# EAGLE design flame sensor final (EAGLE 7.5.0)
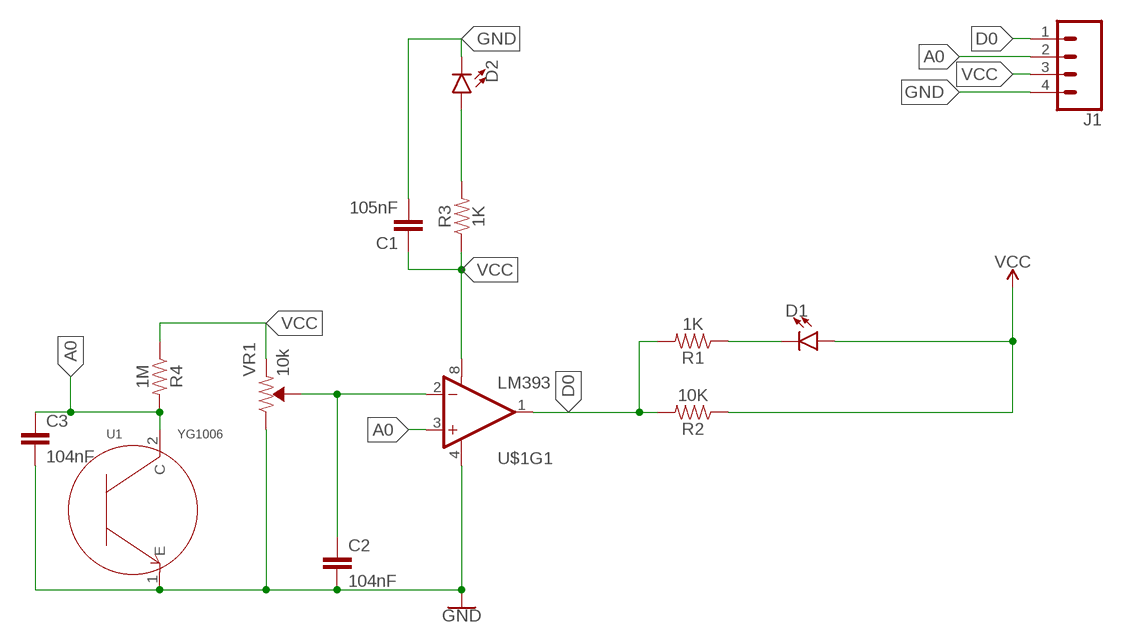
[diagram p0: schematic, sheet 1]

## Parts
C1  105nF  2.2UF-1206-50V-10%  [1206]
C2  104nF  2.2UF-1206-50V-10%  [1206]
C3  104nF  2.2UF-1206-50V-10%  [1206]
D1  LED1206  [LED-1206]
D2  LED1206  [LED-1206]
J1  CONN_04  [1X04]
R1  1K  0.05OHM-0603-1/5W-1%  [0603]
R2  10K  0.05OHM-0603-1/5W-1%  [0603]
R3  1K  0.05OHM-0603-1/5W-1%  [0603]
R4  1M  0.05OHM-0603-1/5W-1%  [0603]
U1  YG1006  YG1006'YG1006'  [2P-2.54-5MM]
U$1  LM393  [SO08]
VR1  10k  TRIMPOT-SMD-5MM-CLOSED-1/4W-20%  [TRIMPOT-SMD-5MM]

## Nets
A0: C3.1 J1.2 R4.2 U1.2(C) U$1.3(+IN)
D0: J1.1 R1.2 R2.2 U$1.1(OUT)
GND: C1.2 C2.2 C3.2 D2.C J1.4 U1.1(E) U$1.4(V-) VR1.C(CW)
N$1: D1.C R1.1
N$2: C2.1 U$1.2(-IN) VR1.B(WIPER)
N$3: D2.A R3.2
VCC: C1.1 D1.A J1.3 R2.1 R3.1 R4.1 U$1.8(V+) VR1.A(CCW)
Unconnected: U$1.5(+IN) U$1.6(-IN) U$1.7(OUT)

## Library data of the parts
C1-C3 = SparkFun-Capacitors:2.2UF: 2.2µF ceramic capacitors A capacitor is a passive two-terminal electrical component used to store electrical energy temporarily in an electric field.; PROD_ID: CAP-10009; VALUE: 2.2uF
D1 D2 = SparkFun-LED:LED: LED (Generic) Standard schematic elements and footprints for 5mm, 3mm, 1206, and 0603 sized LEDs. Generic LEDs with no color specified.
J1 = SparkFun-Connectors:CONN_04: Multi connection point. Often used as Generic Header-pin footprint for 0.1 inch spaced/style header connections On any of the 0.1 inch spaced packages, you can populate with these: Break Away Headers - Straight <https://www.sparkfun.com/products/116> (PRT-00116) Break Away Male Headers - Right Angle <https://www.sparkfun.com/products/553> (PRT-00553) Female Headers <https://www.sparkfun.com/products/115> (PRT-00115) Break Away Headers - Machine Pin <https://www.sparkfun.com/products/117> (PRT-00117) Break Away Female Headers - Swiss Machine Pin <https://www.sparkfun.com/products/743> (PRT-00743) For SCREWTERMINALS and SPRING TERMINALS visit here: Screw Terimnals on SparkFun.com <https://www.sparkfun.com/search/results?term=Screw+Terminals> (5mm/3.5mm/2.54mm spacing) This device is also useful as a general connection point to wire up your design to another part of your project. Our various solder wires solder well into these plated through hole pads. Hook-Up Wire - Assortment (Stranded, 22 AWG) <https://www.sparkfun.com/products/11375> (PRT-11375) Hook-Up Wire - Assortment (Solid Core, 22 AWG) <https://www.sparkfun.com/products/11367> (PRT-11367) View the entire wire category on our website here <https://www.sparkfun.com/categories/141> Special notes: Molex polarized connector foot print use with SKU : PRT-08231 with associated crimp pins and housings. 1MM SMD Version SKU: PRT-10208; PROD_ID: CONN-09696
R1-R4 = SparkFun-Resistors:0.05OHM: 0.05Ω resistor A resistor is a passive two-terminal electrical component that implements electrical resistance as a circuit element. Resistors act to reduce current flow, and, at the same time, act to lower voltage levels within circuits. - Wikipedia; PROD_ID: RES-12535; VALUE: 0.05
U1 = template(1):YG1006: YG1006 is a high speed and high sensitive NPN siicon phototransistor in a atandard 5mm package
U$1 = SparkFun-Retired:LM393: Low-voltage comparator Prototype: IC-09375
VR1 = SparkFun-Resistors:TRIMPOT: Trimming Potentiometer (Trimpot) Three-terminal potentiometers, with an adjustable wiper and two adjustable resistors. A pot can be used to create a configurable voltage divider, or as a variable resistor. "Trimpots" are a subset of potentiometers, usually intended for "set-and-forget" applications. They're often more delicate than standard potentiometers - rated for fewer turns. Variants PTH-KNOB - PTH Trimpot w/ finger-adjustable knob Trimpot 10K with Knob <https://www.sparkfun.com/products/9806> (COM-09806) Datasheet <http://www.sparkfun.com/datasheets/Components/General/TSR-3386.pdf> SMD-3MM-CLOSED-FRAME - SMD 3mm Square Closed-Frame Trimpot Used on e.g. EasyDriver - Stepper Motor Driver <https://www.sparkfun.com/products/12779> Datasheet <http://www.bitechnologies.com/pdfs/22.pdf> (22AR10KTR) SMD-5MM - SMD 5mm Square Closed-Frame Trimpot Used on e.g. IOIO-OTG - V2.2 <https://www.sparkfun.com/products/13613> Datasheet <http://www.vishay.com/docs/51008/ts53.pdf> (TS53YL502MR10) SMD-3MM-1/10W-25% - 3mm Square Open-Frame Trimpot Used on e.g. SparkFun Shapeoko <https://www.sparkfun.com/products/13899> Datasheet <http://www.bourns.com/docs/Product-Datasheets/TC33.pdf> (TC33X-2-103E); PROD_ID: RES-11156; VALUE: 5k

## Board
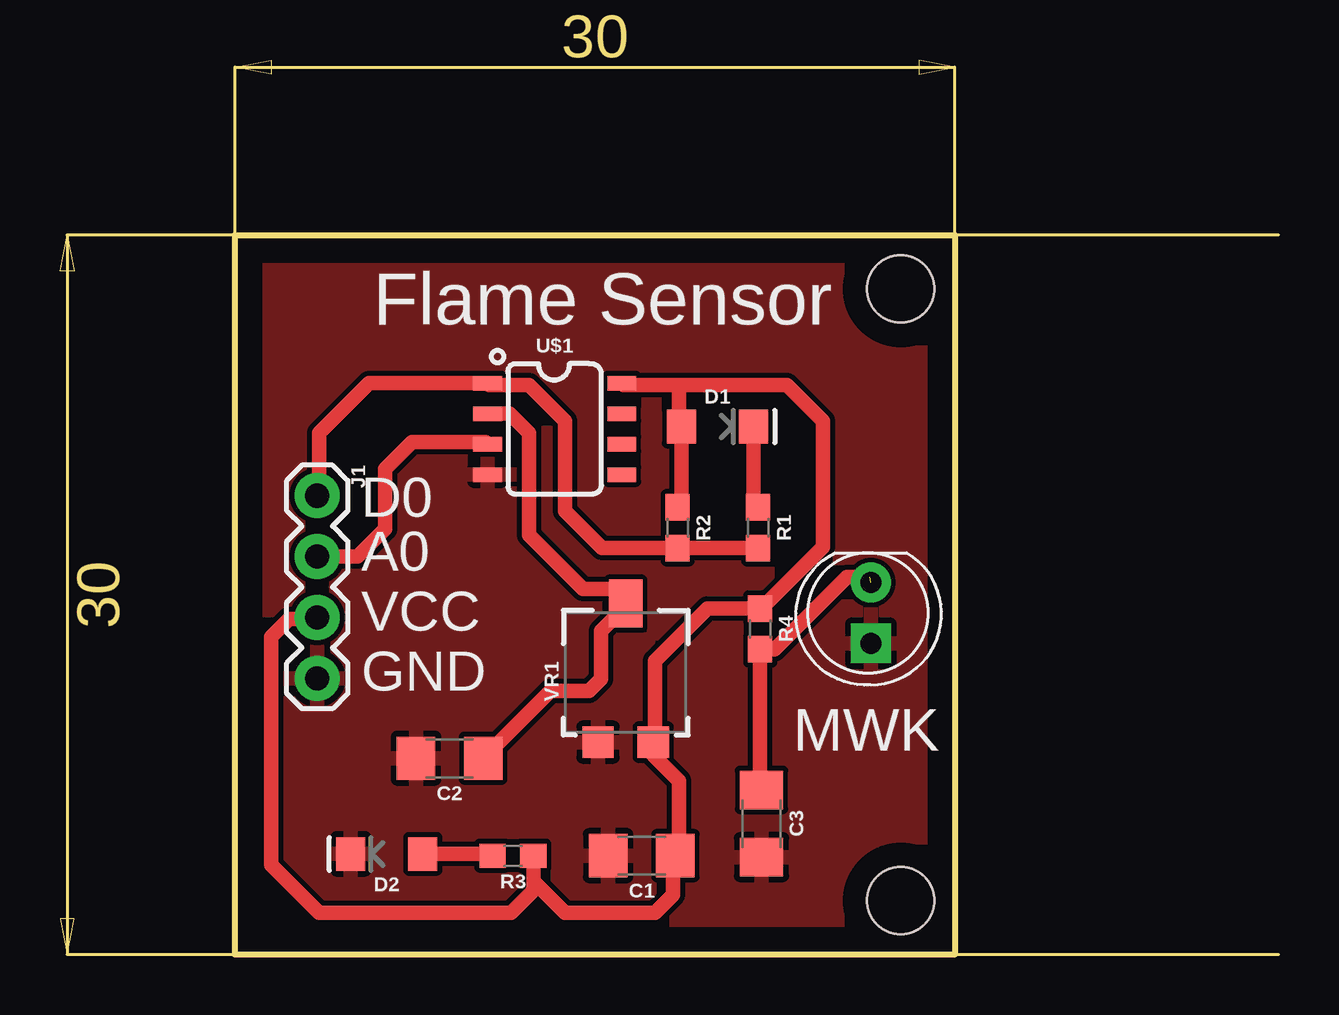
[diagram p1: board, top side]
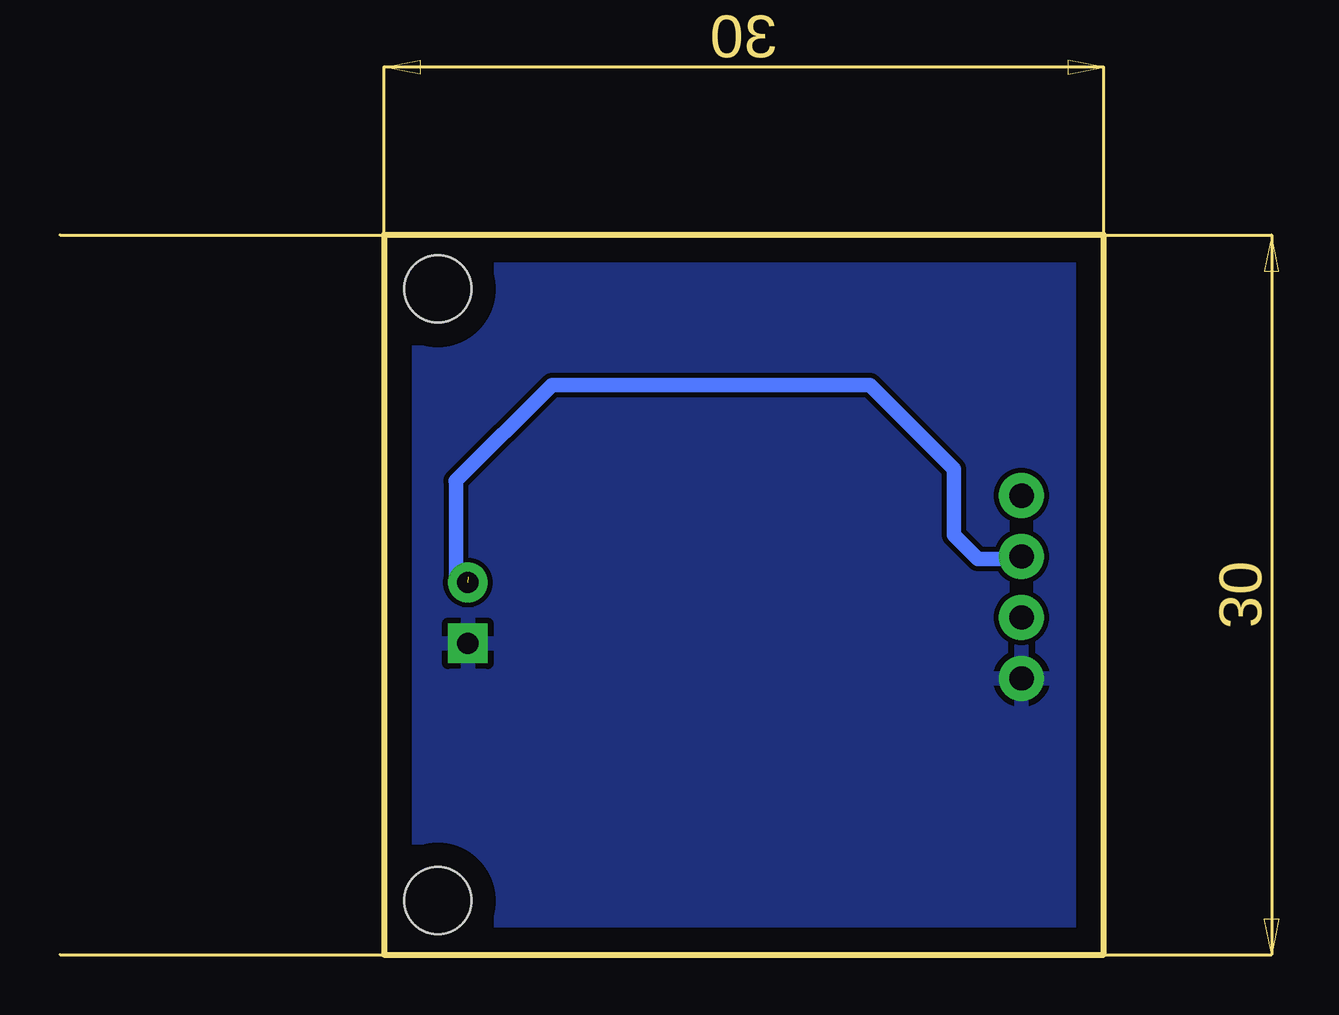
[diagram p2: board, bottom side, seen from below]

Size 30 x 30 mm. Coordinates in mm from the lower left corner, seen from the top.
Outline: 0,30 30,30 30,0 0,0 0,30
Copper layers (1*16): Top 0.035mm / dielectric 1.5mm / Bottom 0.035mm
Design rules "default": minimum track width 10mil, minimum drill 24mil, track to track 8mil, track to pad 8mil, pad to pad 8mil, via to via 8mil, smd to smd 8mil, copper to edge 40mil, drill to drill 8mil, minimum pad ring 10mil, minimum via ring 8mil, stop-mask expansion 4mil, vias tented up to drill 0mil, thermal gap 10mil
Holes 2.8 mm at 27.75,27.75 27.75,2.25

### Footprints (pad centres in the part's own frame; a part is rotated, then mirrored left to right if it is on the bottom)
1206 = smd 1.6 x 1.8: 1 -1.4,0; 2 1.4,0
LED-1206 = smd 1.2 x 1.4: A -1.5,0; C 1.5,0
1X04 = drill 1.016 pad 1.88: 1 0,0; 2 2.54,0; 3 5.08,0; 4 7.62,0
0603 = smd 1.1 x 1: 1 -0.85,0; 2 0.85,0
2P-2.54-5MM = drill 0.889 pad 1.651 square: 1 -1.27,0 | drill 0.889 pad 1.651: 2 1.27,0
SO08 = smd 0.6 x 1.2: 1 -1.905,-2.8; 2 -0.635,-2.8; 3 0.635,-2.8; 4 1.905,-2.8; 5 1.905,2.8; 6 0.635,2.8; 7 -0.635,2.8; 8 -1.905,2.8
TRIMPOT-SMD-5MM = smd 1.3 x 1.3: A 1.15,-2.54; C -1.15,-2.54 | smd 1.402 x 2: B 0,3.239

### Placement (x,y rotation side)
C1  16.95,4.13 180 top
C2  8.94,8.19 180 top
C3  21.94,5.47 270 top
D1  20.1,22.02 0 top
D2  6.32,4.2 180 top
J1  3.42,19.14 270 top
R1  21.8,17.8 270 top
R2  18.44,17.8 270 top
R3  11.58,4.13 180 top
R4  21.88,13.58 270 top
U1  26.5,14.25 90 top
U$1  13.32,21.92 270 top
VR1  16.28,11.4 0 top

### Tracks (layer width: path | path; a pad name or v marks a point on that pad's centre or on a via)
A0  (1 unrouted)
  Top 0.61: U$1.3 10.43,21.38 7.38,21.38 6.25,20.25 6.25,17.75 5.1,16.6 J1.2 | C3.1 21.88,6.93 R4.2 22.48,12.73 25.5,15.75 26.46,15.75
  Bottom 0.61: J1.2 3.52,16.5 5.25,16.5 6.25,17.5 6.25,20.25 9.75,23.75 23,23.75 27.01,19.74 27,19.73 27,15.75 26.77,15.52 U1.2
D0
  Top 0.61: J1.1 3.5,19.22 3.5,21.75 5.58,23.82 U$1.1 10.6,23.75 12.25,23.75 13.75,22.25 13.75,18.5 15.3,16.95 R2.2 R1.2
GND
  pour Bottom: 0,30 30,30 30,0 0,0
  pour Top: 0,30 30,30 30,0 0,0
N$1
  Top 0.61: R1.1 21.6,18.85 D1.C
N$2
  Top 0.61: C2.1 13.15,11 14.75,11 15.25,11.5 15.25,13.5 16.28,14.53 VR1.B 15.67,15.25 14.5,15.25 12.25,17.5 12.25,21.75 11.45,22.55 U$1.2
N$3
  Top 0.61: R3.2 10.66,4.2 D2.A
VCC
  Top 0.61: J1.3 3.36,14 2.25,14 1.5,13.25 1.5,3.75 3.5,1.75 11.5,1.75 12.43,2.68 R3.1 12.43,3.07 13.75,1.75 17.5,1.75 18.25,2.5 18.25,4.03 C1.1 18.5,4.28 18.5,7.25 17.43,8.32 VR1.A 17.5,8.93 17.5,12.25 19.68,14.43 R4.1 21.93,14.43 24.5,17 24.5,22.25 23,23.75 18.5,23.75 | R2.1 18.6,18.81 D1.A 18.5,22.12 18.5,23.75 | U$1.8 16.2,23.75 18.5,23.75

### Text on the board
tPlace: Flame Sensor | D0 | A0 | VCC | GND | MWK